# Altium schematic sheet AEGIS_Junction_Box_driver.SchDoc: AEGIS
size 420 x 297 mm; Author: G.Kasprowicz; CompanyName: WUT ISE; DrawnBy: G.Kasprowicz; Organization: WUT ISE; Address1: PW ISE; Address2: Nowowiejska 15/19 00-665 Warsaw; Address3: gkasprow@gmail.com; Revision: 2; SheetNumber: -; SheetTotal: -; ModifiedBy: -; CheckedDate: -; Title2: Junction Box Driver; DivGrp: WUT ISE; Designer: G.Kasprowicz; ModifiedDate: -; ProjectName: Sensor Box
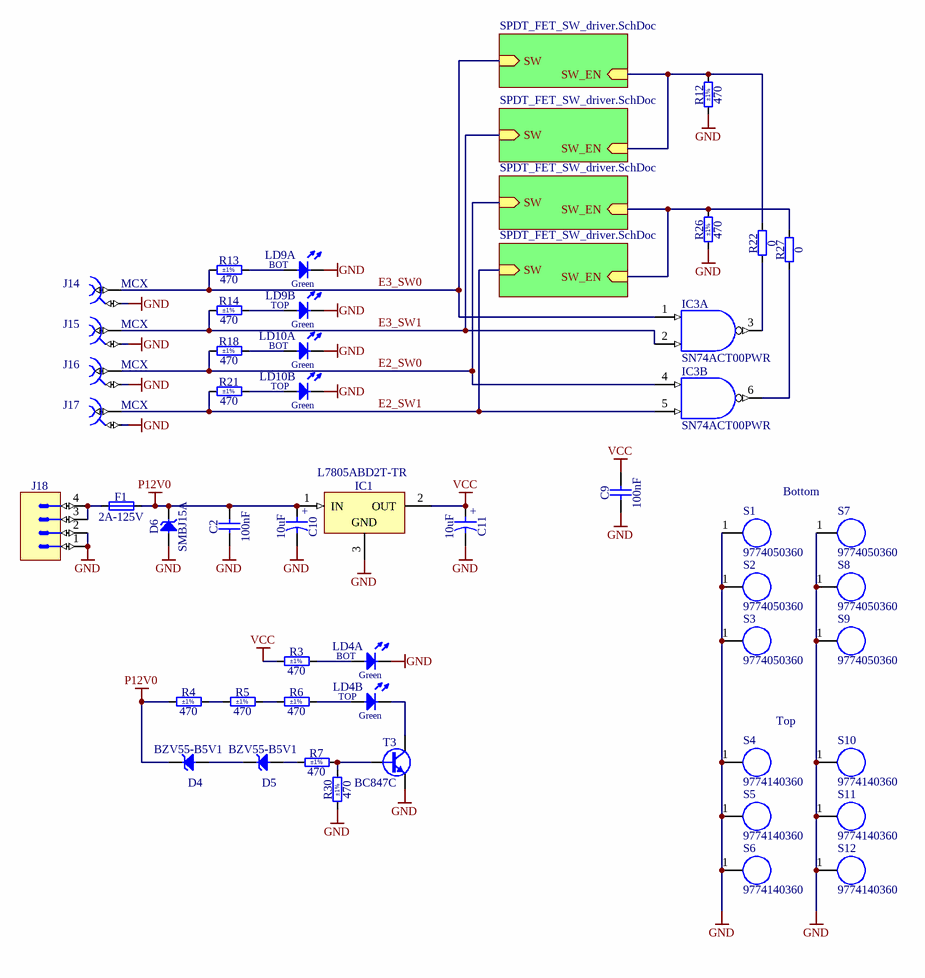
[diagram p0: AEGIS_Junction_Box_driver.SchDoc]

## Parts
C2  100nF  [CAPC1005X55N]
C9  100nF  [CAPC1005X55N]
C10  10uF  [CAPMP3216X180N]
C11  10uF  [CAPMP3216X180N]
D4  BZV55-B5V1  [DIOMELF3515N]
D5  BZV55-B5V1  [DIOMELF3515N]
D6  SMBJ15A  [DIOM5336X265N]
F1  2A-125V  [FUSE_LITTELFUSE_0154]
IC1  L7805ABD2T-TR  [TO254P1542X460-3N-R790X1040]
IC3  SN74ACT00PWR  [SOP65P640X120-14N]  (parts A,B of 4)
J14  MCX  [AMPHENOL_919-383J-51A]
J15  MCX  [AMPHENOL_919-383J-51A]
J16  MCX  [AMPHENOL_919-383J-51A]
J17  MCX  [AMPHENOL_919-383J-51A]
J18  Mini-Fit Jr.™  [MOLEX_39-30-0040]  (value not drawn)
LD4  Green  [LED_DIALIGHT_553-0222-210F]  (value not drawn)  (parts A,B of 2)
LD9  Green  [LED_DIALIGHT_553-0222-210F]  (value not drawn)  (parts A,B of 2)
LD10  Green  [LED_DIALIGHT_553-0222-210F]  (value not drawn)  (parts A,B of 2)
R3  470  Tolerance: ±1%  [RESC1608X55N]
R4  470  Tolerance: ±1%  [RESC1608X55N]
R5  470  Tolerance: ±1%  [RESC1608X55N]
R6  470  Tolerance: ±1%  [RESC1608X55N]
R7  470  Tolerance: ±1%  [RESC1608X55N]
R12  470  Tolerance: ±1%  [RESC1608X55N]
R13  470  Tolerance: ±1%  [RESC1608X55N]
R14  470  Tolerance: ±1%  [RESC1608X55N]
R18  470  Tolerance: ±1%  [RESC1608X55N]
R21  470  Tolerance: ±1%  [RESC1608X55N]
R22  0  [RESC1608X55N]
R26  470  Tolerance: ±1%  [RESC1608X55N]
R27  0  [RESC1608X55N]
R30  470  Tolerance: ±1%  [RESC1608X55N]
S1  9774050360  [9774050360]
S2  9774050360  [9774050360]
S3  9774050360  [9774050360]
S4  9774140360  [9774140360]
S5  9774140360  [9774140360]
S6  9774140360  [9774140360]
S7  9774050360  [9774050360]
S8  9774050360  [9774050360]
S9  9774050360  [9774050360]
S10  9774140360  [9774140360]
S11  9774140360  [9774140360]
S12  9774140360  [9774140360]
T3  BC847C  [SOT95P240X110-3N]

## Sub-sheets
SPDT_HV_SW0 = SPDT_FET_SW_driver.SchDoc: SW (in), SW_EN (in)
SPDT_HV_SW1 = SPDT_FET_SW_driver.SchDoc: SW (in), SW_EN (in)
SPDT_HV_SW2 = SPDT_FET_SW_driver.SchDoc: SW (in), SW_EN (in)
SPDT_HV_SW3 = SPDT_FET_SW_driver.SchDoc: SW (in), SW_EN (in)

## Nets
GND: C2.1 C9.1 C10.2 C11.2 D6.2(A) IC1.3(GND) IC3.7(GND) J14.2 J15.2 J16.2 J17.2 J18.1 J18.2 LD4.2(C) LD9.2(C) LD9.4(C) LD10.2(C) LD10.4(C) R12.1 R26.1 R30.1 S1.1 S2.1 S3.1 S4.1 S5.1 S6.1 S7.1 S8.1 S9.1 S10.1 S11.1 S12.1 T3.2(E)
P12V0: C2.2 C10.1 D4.1(C) D6.1(C) F1.2 IC1.1(IN) R4.1
VCC: C9.2 C11.1 IC1.2(OUT) IC3.14(VCC) R3.1
E2_SW0: IC3.4(A) J16.1 R18.1 ; sheet SPDT_HV_SW2/SW
E2_SW1: IC3.5(B) J17.1 R21.1 ; sheet SPDT_HV_SW3/SW
E3_SW0: IC3.1(A) J14.1 R13.1 ; sheet SPDT_HV_SW0/SW
E3_SW1: IC3.2(B) J15.1 R14.1 ; sheet SPDT_HV_SW1/SW
NetD4_2: D4.2(A) D5.1(C)
NetD5_2: D5.2(A) R7.1
NetF1_1: F1.1 J18.3 J18.4
NetIC3_3: IC3.3(~{O}) R22.1
NetIC3_6: IC3.6(~{O}) R27.1
NetLD4_1: LD4.1(A) R3.2
NetLD4_3: LD4.3(A) R6.2
NetLD4_4: LD4.4(C) T3.3(C)
NetLD9_1: LD9.1(A) R13.2
NetLD9_3: LD9.3(A) R14.2
NetLD10_1: LD10.1(A) R18.2
NetLD10_3: LD10.3(A) R21.2
NetR4_2: R4.2 R5.1
NetR5_2: R5.2 R6.1
NetR7_2: R7.2 R30.2 T3.1(B)
NetR12_2: R12.2 R22.2 ; sheet SPDT_HV_SW0/SW_EN, sheet SPDT_HV_SW1/SW_EN
NetR26_2: R26.2 R27.2 ; sheet SPDT_HV_SW2/SW_EN, sheet SPDT_HV_SW3/SW_EN

## Notes on the sheet
- Bottom
- Top
- Project/Equipment
- Document
- Designer
- Drawn by
- Check.by
- Copyright WUT ISE 2020.
  This documentation describes Open Hardware and is licensed under the CERN OHL v.1.2. You may redistribute and modify this documentation under the terms of the CERN OHL v.1.2. (http://ohwr.org/CERNOHL). This documentation is distributed WITHOUT ANY EXPRESS OR IMPLIED WARRANTY, INCLUDING OF MERCHANTABILITY, SATISFACTORY QUALITY AND FITNESS FOR A PARTICULAR PURPOSE. Please see the CERN OHL v.1.2 for applicable conditions.
- Contact
- File
- Last Mod.
- Print Date
- Sheet
- Size
- A3
- of
- Rev
- (in symbol CTE3216-18_10UF_16V_20%_AVX_TCJ) +
- (in symbol LED_DIALIGHT_553-0222-210F, part A) BOT
- (in symbol LED_DIALIGHT_553-0222-210F, part B) TOP

## Library data of the parts
C2 C9 = CC0402_100NF_16V_10%_X7R: Non-polarised capacitor; Part Description: SMD Multilayer Chip Ceramic Capacitor; Manufacturer: GENERIC; Manufacturer1 Part Number: GRM155R71C104KA88D; Voltage: 16V; TC: X7R; Tolerance: ±10%; Part Number: CC0402_100NF_16V_10%_X7R; Component Kind: Standard; Component Type: Standard; Pin Count: 2; Value: 100nF; Status: Not Recommended; Manufacturer Part Number: CC0402_100NF_16V_10%_X7R; Case: 0402; Mounted: Yes; Socket: No; SMD: Yes; Sense: No; Manufacturer1 Example: MURATA; Manufacturer1 ComponentHeight: 0.55mm; HelpURL: \\cern.ch\dfs\Applications\Altium\Datasheets\CC0402_X7R_MURATA_GRM.pdf; Author: CERN DEM JLC; CreateDate: 05.12.2013; LatestRevisionDate: 03.12.2007
C10 C11 = CTE3216-18_10UF_16V_20%_AVX_TCJ: Polarised capacitor; Part Description: ESR 0R200 Tantalum Solid Electrolytic Chip Capacitor with Conductive Polymer Electrode; Manufacturer: AVX; Manufacturer Part Number: TCJA106M016R0200; Voltage: 16V; Tolerance: ±20%; Part Number: CTE3216-18_10UF_16V_20%_AVX_TCJ; Component Kind: Standard; Component Type: Standard; Pin Count: 2; Value: 10uF; Status: Preferred; Case: A; Mounted: Yes; Socket: No; SMD: Yes; Sense: No; ComponentHeight: 1.8mm; HelpURL: \\cern.ch\dfs\Applications\Altium\Datasheets\CTE_AVX_TCJ.pdf; Author: CERN DEM JLC; CreateDate: 29.03.2012; LatestRevisionDate: 29.03.2012
D4 D5 = BZV55-B5V1: Zener Diode; Part Description: Voltage Regulator Diode; Manufacturer: NEXPERIA; Voltage: 5V1; Power: 500mW; PressFit: No; Bonding: No; Part Number: BZV55-B5V1; Component Kind: Standard; Component Type: Standard; Device: BZV55-B5V1; PackageDescription: SOD80C, MELF Diode, 2-Leads, Body 3.5x1.5mm, IPC Medium Density; Manufacturer Part Number: BZV55-B5V1; Pin Count: 2; Case: SOD-80C; Mounted: Yes; Socket: No; SMD: Yes; Sense: No; ComponentHeight: 1.6mm; HelpURL: \\cern.ch\dfs\Applications\Altium\Datasheets\BZV55.pdf; Author: CERN DEM JLC; CreateDate: 06.05.2008; LatestRevisionDate: 22.01.2018
D6 = SMBJ15A: Zener Diode; Part Description: Uni-Directional Transient Voltage Suppressor Diode; Manufacturer: FAIRCHILD SEMICONDUCTOR; Voltage: 15V; Power: 600W; PressFit: No; Bonding: No; Part Number: SMBJ15A; Component Kind: Standard; Component Type: Standard; Device: SMBJ15A; PackageDescription: DO-214-AA/SMB Diode, Molded Body; 5.34mm L X 3.625mm W X 2.65mm H, IPC Medium Density; Manufacturer Part Number: SMBJ15A; Pin Count: 2; Case: DO-214AA; Mounted: Yes; Socket: No; SMD: Yes; Sense: No; ComponentHeight: 2.65mm; HelpURL: \\cern.ch\dfs\Applications\Altium\Datasheets\SMBJ.pdf; Author: CERN DEM JLC; CreateDate: 08.12.2008; LatestRevisionDate: 19.12.2011
F1 = FUSE_LITTELFUSE_0154002.DRT: Fuse; Part Description: SMF OMNI-BLOK® Fuse With Time Lag (Slo-Blo®) and Holder; PressFit: No; Part Number: FUSE_LITTELFUSE_0154002.DRT; Component Kind: Standard; Component Type: Standard; Pin Count: 2; PackageDescription: SMF Fuse and Holder, 2-Leads, Body 9.73x5.03mm; Family: Fuse & Holder; Mounted: Yes; Socket: No; SMD: Yes; Sense: No; Value: 2A-125V; Manufacturer: LITTELFUSE; Manufacturer Part Number: 0154002.DRT; ComponentHeight: 3.81mm; HelpURL: \\cern.ch\dfs\Applications\Altium\Datasheets\FUSE_LITTELFUSE_0154.pdf; Author: CERN DEM JLC; CreateDate: 06.08.2009; LatestRevisionDate: 06.08.2009
IC1 = L7805ABD2T-TR: 3-Terminal Regulator 1=IN 2=OUT 3=GND; Part Description: 5V 1.5A Positive Voltage Regulator; Manufacturer: ST MICROELECTRONICS; PressFit: No; Bonding: No; Part Number: L7805ABD2T-TR; Component Kind: Standard; Component Type: Standard; Device: L7805ABD2T-TR; PackageDescription: D2PAK TO-263, TO, 2.54mm Pitch; 2 Pin, 15.425mm L X 9.15mm W X 4.60mm H body, IPC Medium Density; Manufacturer Part Number: L7805ABD2T-TR; Pin Count: 3; Case: TO-263-2; Mounted: Yes; Socket: No; SMD: Yes; Sense: No; ComponentHeight: 4.6mm; HelpURL: \\cern.ch\dfs\Applications\Altium\Datasheets\L7805ABD2T-TR.pdf; Author: CERN DEM JLC; CreateDate: 13.12.2011; LatestRevisionDate: 13.12.2011
IC3 = SN74ACT00PWR: Quad 2-Input NAND Gate; Part Description: Quadruple 2-Input Positive-NAND Gate; Manufacturer: TEXAS INSTRUMENTS; PressFit: No; Bonding: No; Part Number: SN74ACT00PWR; Component Kind: Standard; Component Type: Standard; Device: SN74ACT00PWR; PackageDescription: SOP, 0.65mm Pitch; 14 Pin, 4.40mm W X 5.00mm L X 1.20mm H body, IPC Medium Density; Manufacturer Part Number: SN74ACT00PWR; Pin Count: 14; Case: TSSOP14; Mounted: Yes; Socket: No; SMD: Yes; Sense: No; ComponentHeight: 1.2mm; Author: CERN DEM JLC; HelpURL: \\cern.ch\dfs\Applications\Altium\Datasheets\SN74ACT00PWR.pdf; CreateDate: 17.03.2014; LatestRevisionDate: 17.03.2014
J14-J17 = AMPHENOL_919-383J-51A: Part Description: 50 Ohm, RF Connector, MCX Right Angle PCB Receptacle Jack; PressFit: No; Part Number: AMPHENOL_919-383J-51A; Component Kind: Standard; Component Type: Standard; Pin Count: 5; Family: MCX; Mounted: Yes; Socket: No; SMD: No; Sense: No; Status: None; Manufacturer: AMPHENOL; Manufacturer Part Number: 919-383J-51A; ComponentHeight: 6mm; HelpURL: \\cern.ch\dfs\Applications\Altium\Datasheets\AMPHENOL_919-383J-51A.pdf; Author: CERN DEM BC; CreateDate: 31.01.2019; LatestRevisionDate: 31.01.2019
J18 = MOLEX_39-30-0040: Connector 4 Male; Part Description: 4.20mm (.165") Pitch Mini-Fit Jr. Header, Dual Row, Right Angle with Snap-in Plastic Peg PCB Lock, 4 Circuits; Manufacturer: MOLEX; PressFit: No; Part Number: MOLEX_39-30-0040; Component Kind: Standard; Component Type: Standard; Pin Count: 4; Family: Mini-Fit Jr.™; Mounted: Yes; Socket: No; SMD: No; Sense: No; Status: None; Manufacturer Part Number: 39-30-0040; ComponentHeight: 11.4mm; HelpURL: \\cern.ch\dfs\Applications\Altium\Datasheets\MOLEX_39-30-0040.pdf; Author: CERN DEM JLC; CreateDate: 2018-10-02; LatestRevisionDate: 2018-10-02
LD4 LD9 LD10 = LED_DIALIGHT_553-0222-210F: LED x2 Green 1A2C-BOT_3A4C-TOP; Part Description: Dual 3mm Green LED CBI® Circuit Board Indicator, Low Current, Reverse Cathode Right; PressFit: No; Bonding: No; Part Number: LED_DIALIGHT_553-0222-210F; Component Kind: Standard; Component Type: Standard; Color: Green; PackageDescription: Dual 3mm Green LED, Body 10.55x4.32mm, Pin spacing 2.54mm, Reverse Cathode Right; Manufacturer: DIALIGHT; Manufacturer Part Number: 553-0222-210F; Pin Count: 4; Mounted: Yes; Socket: No; SMD: No; Sense: No; ComponentHeight: 9.65mm; HelpURL: \\cern.ch\dfs\Applications\Altium\Datasheets\LED_DIALIGHT_553-0222-210F.pdf; Author: CERN DEM BC; CreateDate: 18.08.2016; LatestRevisionDate: 18.08.2016
R3-R7 R12-R14 R18 R21 R26 R30 = R0603_470R_1%_0.1W_100PPM: Resistor - 1%; Part Description: General Purpose Thick Film Chip Resistor; Manufacturer: GENERIC; Manufacturer1 Part Number: NRC06F4700TRF; Power: 0.1W; TC: ±100ppm/°C; PressFit: No; Part Number: R0603_470R_1%_0.1W_100PPM; Component Kind: Standard; Component Type: Standard; Pin Count: 2; Value: 470; Status: Preferred; Manufacturer Part Number: R0603_470R_1%_0.1W_100PPM; Case: 0603; Mounted: Yes; Sense: No; Socket: No; SMD: Yes; Manufacturer1 Example: NIC COMPONENT; Manufacturer1 ComponentHeight: 0.55mm; HelpURL: \\cern.ch\dfs\Applications\Altium\Datasheets\R0603_NIC_NRC.pdf; Author: CERN DEM JLC; CreateDate: 03.12.2007; LatestRevisionDate: 13.03.2008
R22 R27 = R0603_0R_JUMPER: Resistor; Part Description: 1A (0.05R Max DC Resistance) Zero Ohm Jumper; Manufacturer: GENERIC; Manufacturer1 Part Number: NRC06Z0; PressFit: No; Part Number: R0603_0R_JUMPER; Component Kind: Standard; Component Type: Standard; Pin Count: 2; Value: 0; Status: Preferred; Manufacturer Part Number: R0603_0R_JUMPER; Case: 0603; Mounted: Yes; Sense: No; Socket: No; SMD: Yes; Manufacturer1 Example: NIC COMPONENT; Manufacturer1 ComponentHeight: 0.55mm; HelpURL: \\cern.ch\dfs\Applications\Altium\Datasheets\R0603_NIC_NRC.pdf; Author: CERN DEM JLC; CreateDate: 03.12.2007; LatestRevisionDate: 13.03.2008
S1-S3 S7-S9 = WA-SMSI,  9774050360: WA-SMSI SMD Steel Spacer with internal Thread; Manufacturer: Wurth Elektronik; partNo: 9774050360; ComponentLink1Description: Manufacturer; ComponentLink1URL: http://www.we-online.de; Created by: Baojun Chen; Created Date: 20.Oct.2015; ComponentLink2Description: Datasheet; ComponentLink2URL: http://katalog.we-online.de/em/datasheet/9774050360.pdf
S4-S6 S10-S12 = WA-SMSI,  9774140360: WA-SMSI SMD Steel Spacer with internal Thread; Manufacturer: Wurth Elektronik; partNo: 9774140360; ComponentLink1Description: Manufacturer; ComponentLink1URL: http://www.we-online.de; Created by: Baojun Chen; Created Date: 20.Oct.2015; ComponentLink2Description: Datasheet; ComponentLink2URL: http://katalog.we-online.de/em/datasheet/9774140360.pdf
T3 = BC847C: NPN Transistor; Part Description: 45V 100mA NPN Silicon AF Transistor; Manufacturer: INFINEON; PressFit: No; Bonding: No; Part Number: BC847C; Component Kind: Standard; Component Type: Standard; Device: BC847C; PackageDescription: SOT23, 0.95mm Pitch; 3 Pin, 1.40mm W X 3.00mm L X 1.10mm H body, IPC Medium Density; Manufacturer Part Number: BC847C; Pin Count: 3; Case: SOT23-3; Mounted: Yes; Socket: No; SMD: Yes; Sense: No; ComponentHeight: 1.1mm; HelpURL: \\cern.ch\dfs\Applications\Altium\Datasheets\BC847C.pdf; Author: CERN DEM JLC; CreateDate: 23.09.2014; LatestRevisionDate: 23.09.2014